# EAGLE design VPower_feed (EAGLE 6.3)
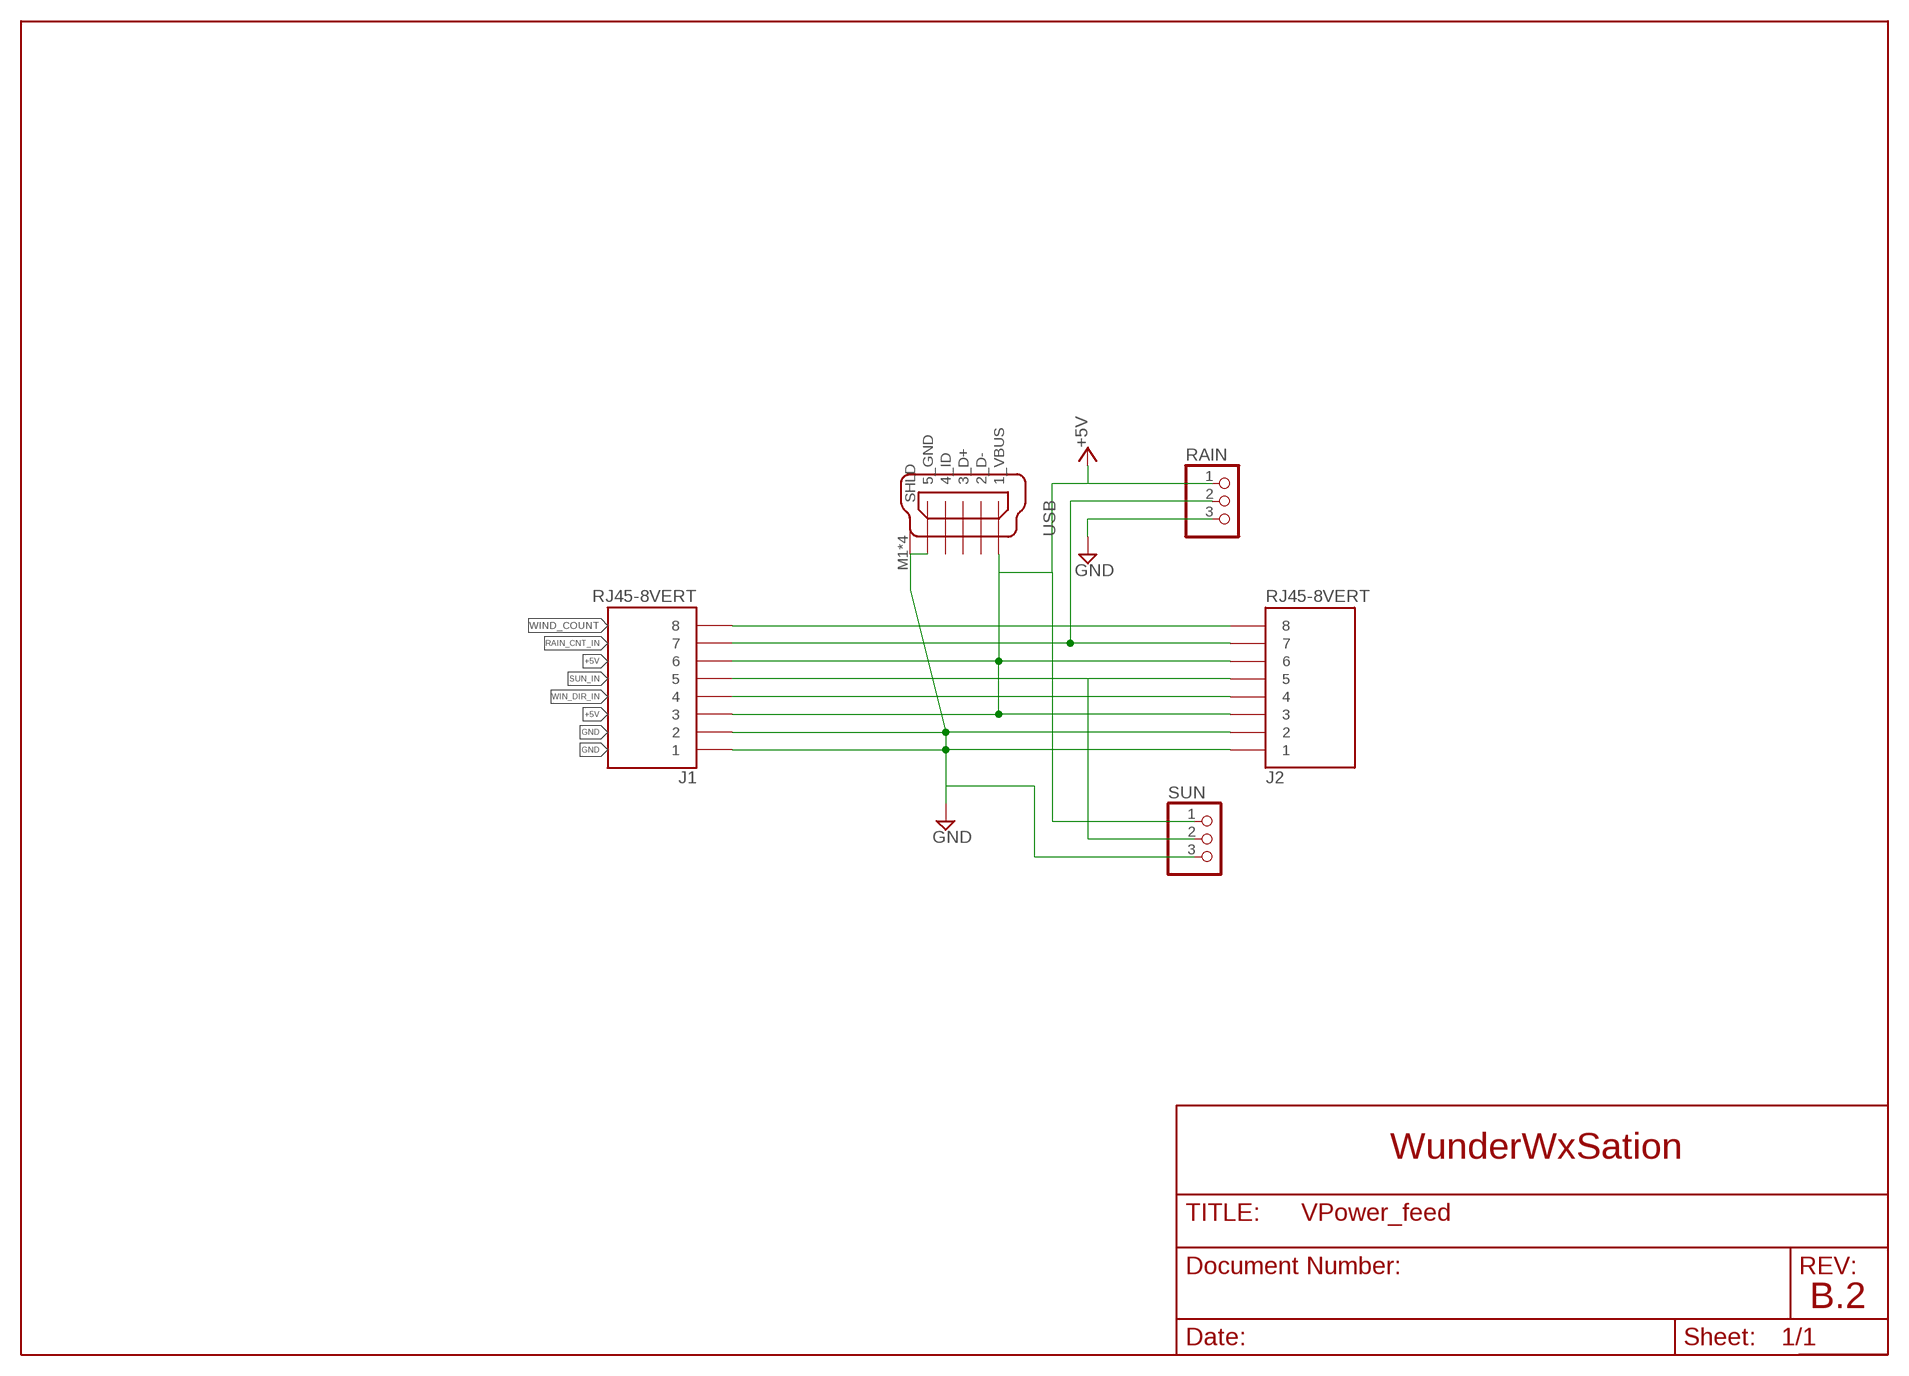
[diagram p0: schematic, sheet 1]

## Parts
J1  RJ45-8VERT  [RJ45_VERT]
J2  RJ45-8VERT  [RJ45_VERT]
RAIN  PINHD-1X3MOLEX_KK  [1X3_MOLEX_KK]
SUN  PINHD-1X3MOLEX_KK  [1X3_MOLEX_KK]
USB  MINI-USB-32005-301  [32005-301]

## Nets
+5V: J1.P$3 J1.P$6 J2.P$3 J2.P$6 RAIN.1 SUN.1 USB.1_VBUS
GND: J1.P$1 J1.P$2 J2.P$1 J2.P$2 RAIN.3 SUN.3 USB.5_USB_GND(5_GND) USB.M1(SHLD) USB.M2(SHLD) USB.M3(SHLD) USB.M4(SHLD)
RAIN_CNT_IN: J1.P$7 J2.P$7 RAIN.2
SUN_IN: J1.P$5 J2.P$5 SUN.2
WIN_DIR_IN: J1.P$4 J2.P$4
WIND_COUNT: J1.P$8 J2.P$8
Unconnected: USB.2_D- USB.3_D+ USB.4_ID

## Notes on the sheet
- WunderWxSation
- B.2

## Library data of the parts
J1 J2 = wifi_WX:RJ45-8: RJ45 Jack Simple RJ45, 8-pin connection - connector for common Cat5, Cat5e, and Cat6 Ethernet cables. Footprint not yet proven in production. Connector sku is PRT-00643; Breakout PCB sku is BOB-00716.
RAIN SUN = wifi_WX:PINHD-1X3: PIN HEADER
USB = wifi_WX:MINI-USB-: MINI USB-B Conector Source: www.cypressindustries.com

## Board
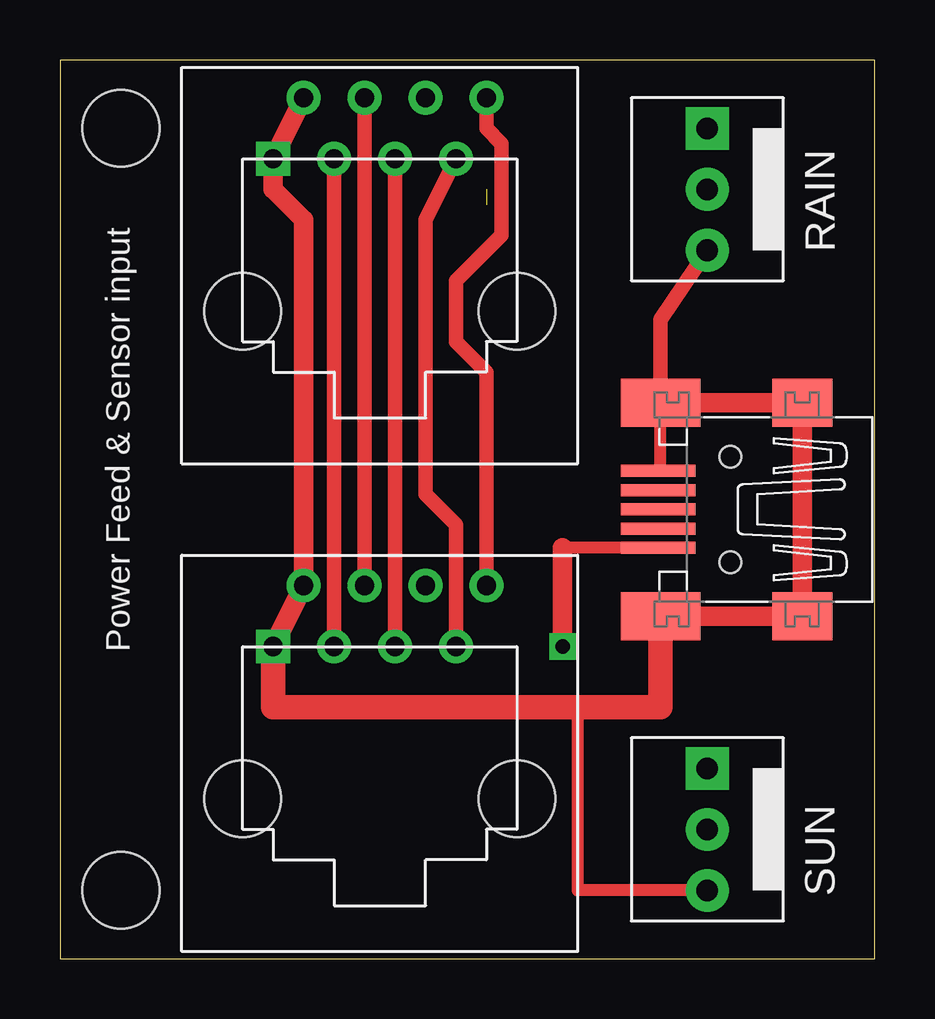
[diagram p1: board, top side]
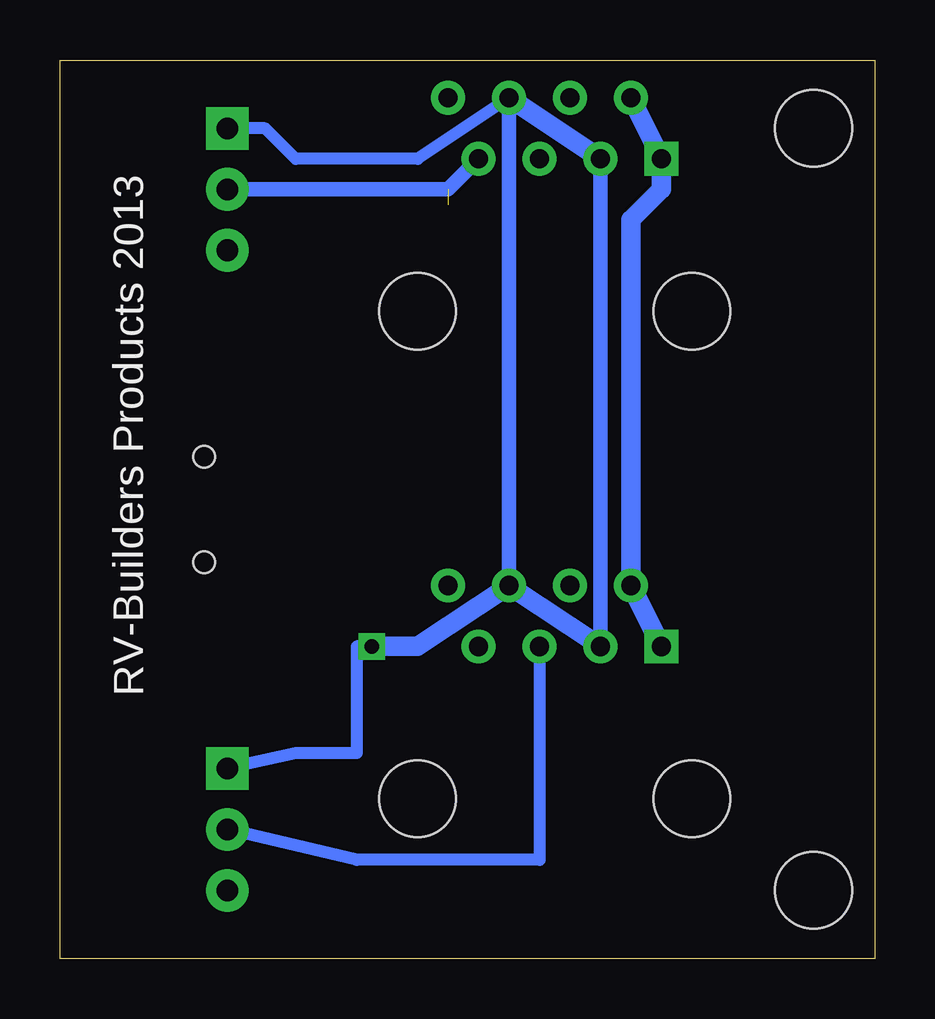
[diagram p2: board, bottom side, seen from below]

Size 33.96 x 37.45 mm. Coordinates in mm from the lower left corner, seen from the top.
Outline: 0,0 33.96,0 33.96,37.45 0,37.45 0,0
Copper layers (1*16): Top 0.035mm / dielectric 1.5mm / Bottom 0.035mm
Design rules "sparkfun": minimum track width 8mil, minimum drill 20mil, track to track 8mil, track to pad 8mil, pad to pad 8mil, via to via 8mil, smd to smd 8mil, copper to edge 10mil, drill to drill 8mil, minimum pad ring 12mil, minimum via ring 10mil, stop-mask expansion 4mil, vias tented up to drill 25mil, thermal gap 10mil
Holes 3.2 mm at 2.54,2.86 2.54,34.61

### Footprints (pad centres in the part's own frame; a part is rotated, then mirrored left to right if it is on the bottom)
RJ45_VERT = drill 0.8 square: P$1 1.27,6.35 | drill 0.8: P$2 2.54,8.89; P$3 3.81,6.35; P$4 5.08,8.89; P$5 6.35,6.35; P$6 7.62,8.89; P$7 8.89,6.35; P$8 10.16,8.89 | hole 3.2: 0,0; 11.43,0
1X3_MOLEX_KK = drill 0.9 pad 1.778 square: 1 1.27,3.175 | drill 0.9 pad 1.778: 2 3.81,3.175; 3 6.35,3.175
32005-301 = smd 3.1 x 0.5: 1_VBUS 3,1.6; 2_D- 3,0.8; 3_D+ 3,0; 4_ID 3,-0.8; 5_USB_GND 3,-1.6 | smd 2.5 x 2: M1 -3,-4.45; M2 -3,4.45 | smd 3.3 x 2: M3 2.9,4.45; M4 2.9,-4.45 | hole 0.9: 0,2.2; 0,-2.2

### Placement (x,y rotation side)
J1  7.62,26.99 0 top
J2  7.62,6.67 0 top
RAIN  23.81,35.88 270 top
SUN  23.81,9.21 270 top
USB  27.94,18.73 180 top

### Tracks (layer width: path | path; a pad name or v marks a point on that pad's centre or on a via)
+5V  (via drill 0.6)
  Top 0.406: USB.1_VBUS 26.03,17.13
  Top 0.508: USB.1_VBUS 20.95,17.13
  Top 0.61: J1.P$3 J2.P$3
  Top 0.813: 20.95,17.13 v20.95,13.02
  Bottom 0.508: J1.P$6 19.05,33.34 24.13,33.34 25.4,34.61 RAIN.1 | v20.95,13.02 21.59,13.02 21.59,8.57 24.13,8.57 SUN.1
  Bottom 0.61: J1.P$3 J2.P$3 | J1.P$6 J2.P$6
  Bottom 0.813: J1.P$6 J1.P$3 | J2.P$3 J2.P$6 19.05,13.02 v20.95,13.02
GND
  Top 0.508: USB.5_USB_GND 25.04,20.43 USB.M4 | SUN.3 21.59,2.86 21.59,10.48
  Top 0.61: RAIN.3 25.04,26.63 USB.M4
  Top 0.813: USB.M4 USB.M1 USB.M2 USB.M3 | J1.P$2 J1.P$1 8.89,32.07 10.16,30.8 J2.P$2 J2.P$1
  Top 1.016: USB.M3 25.04,10.48 21.59,10.48 8.89,10.48 J2.P$1
  Bottom 0.813: J2.P$1 J2.P$2 10.16,30.8 8.89,32.07 J1.P$1 J1.P$2
RAIN_CNT_IN  (1 unrouted)
  Top 0.61: J1.P$7 15.24,30.8 15.24,19.37 16.51,18.1 J2.P$7
  Bottom 0.61: RAIN.2 17.78,32.07 J1.P$7
SUN_IN
  Top 0.61: J1.P$5 J2.P$5
  Bottom 0.508: J2.P$5 13.97,4.13 21.59,4.13 SUN.2
WIN_DIR_IN
  Top 0.61: J2.P$4 J1.P$4
WIND_COUNT
  Top 0.61: J1.P$8 17.78,34.61 18.41,33.97 18.41,30.16 16.51,28.26 16.51,25.72 17.78,24.45 J2.P$8

### Text on the board
tPlace: Power Feed & Sensor input
bPlace: RV-Builders Products 2013